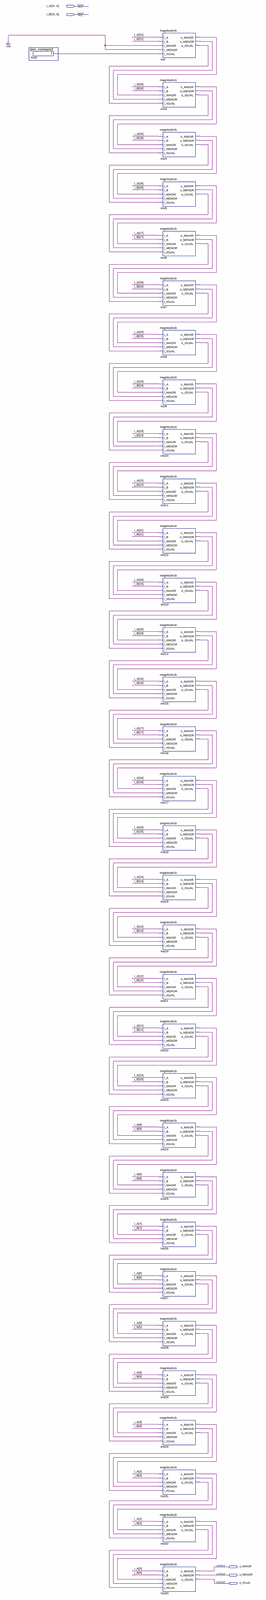
[diagram p0: schematic sheet, whole]
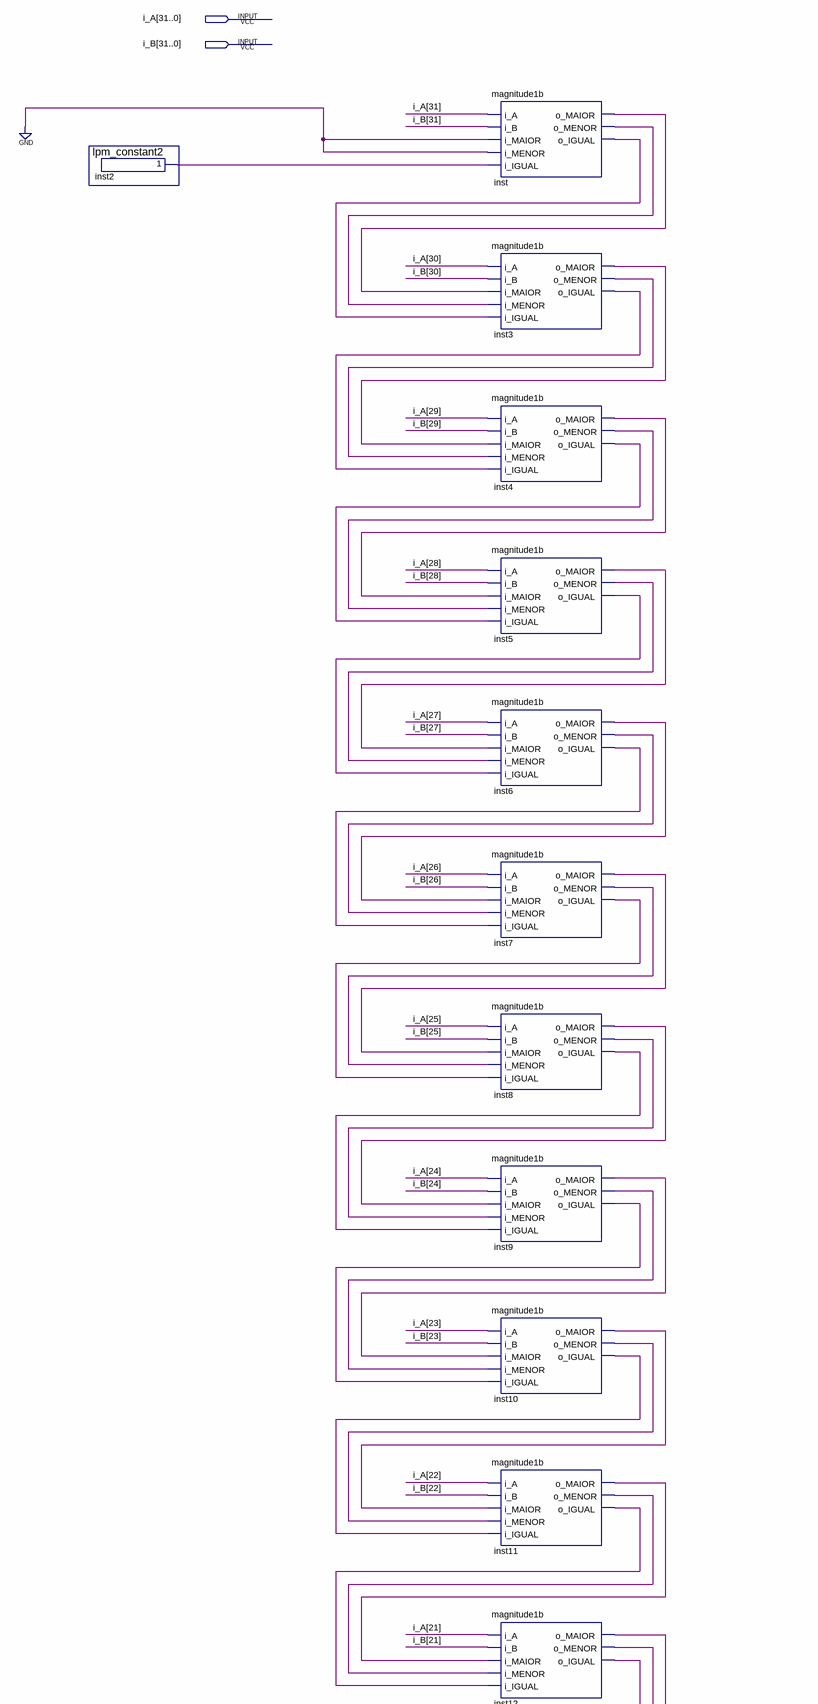
[diagram p1: schematic sheet, upper part]
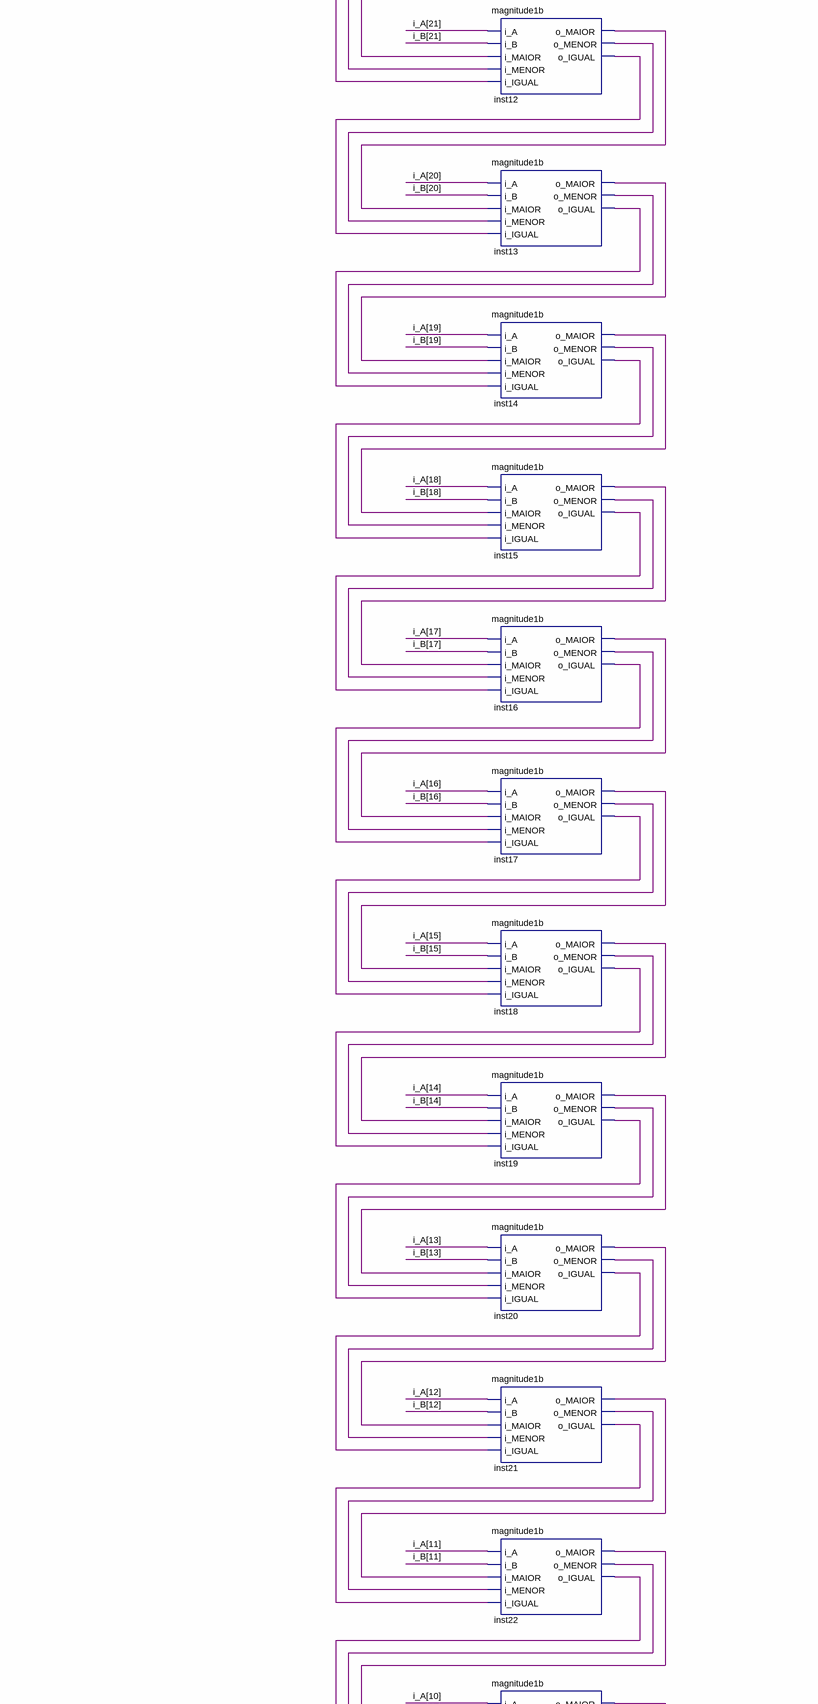
[diagram p2: schematic sheet, middle part]
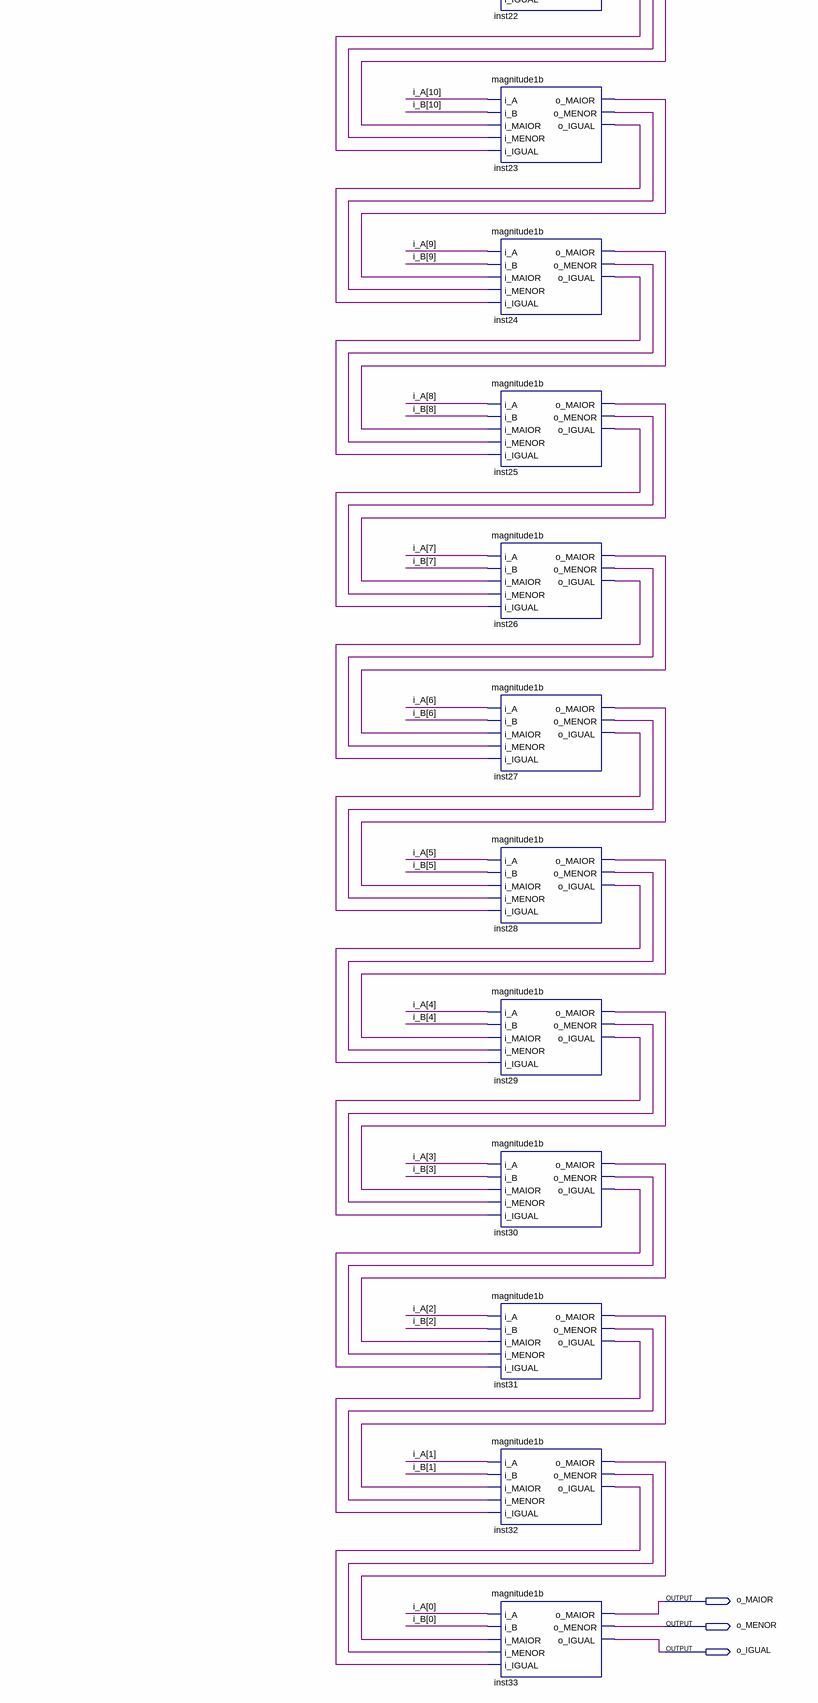
[diagram p3: schematic sheet, lower part]
// Quartus schematic magnitude32b.bdf as structural Verilog: 33 symbols, 5 pins
module magnitude32b (
  input  [31:0] i_A,
  input  [31:0] i_B,
  output o_MAIOR,
  output o_MENOR,
  output o_IGUAL
);

  wire inst2_result, inst3_o_igual, inst3_o_maior, inst3_o_menor, inst4_o_igual, inst4_o_maior,
       inst4_o_menor, inst5_o_igual, inst5_o_maior, inst5_o_menor, inst6_o_igual, inst6_o_maior,
       inst6_o_menor, inst7_o_igual, inst7_o_maior, inst7_o_menor, inst8_o_igual, inst8_o_maior,
       inst8_o_menor, inst9_o_igual, inst9_o_maior, inst9_o_menor, inst10_o_igual, inst10_o_maior,
       inst10_o_menor, inst11_o_igual, inst11_o_maior, inst11_o_menor, inst12_o_igual, inst12_o_maior,
       inst12_o_menor, inst13_o_igual, inst13_o_maior, inst13_o_menor, inst14_o_igual, inst14_o_maior,
       inst14_o_menor, inst15_o_igual, inst15_o_maior, inst15_o_menor, inst16_o_igual, inst16_o_maior,
       inst16_o_menor, inst17_o_igual, inst17_o_maior, inst17_o_menor, inst18_o_igual, inst18_o_maior,
       inst18_o_menor, inst19_o_igual, inst19_o_maior, inst19_o_menor, inst20_o_igual, inst20_o_maior,
       inst20_o_menor, inst21_o_igual, inst21_o_maior, inst21_o_menor, inst22_o_igual, inst22_o_maior,
       inst22_o_menor, inst23_o_igual, inst23_o_maior, inst23_o_menor, inst24_o_igual, inst24_o_maior,
       inst24_o_menor, inst25_o_igual, inst25_o_maior, inst25_o_menor, inst26_o_igual, inst26_o_maior,
       inst26_o_menor, inst27_o_igual, inst27_o_maior, inst27_o_menor, inst28_o_igual, inst28_o_maior,
       inst28_o_menor, inst29_o_igual, inst29_o_maior, inst29_o_menor, inst30_o_igual, inst30_o_maior,
       inst30_o_menor, inst31_o_igual, inst31_o_maior, inst31_o_menor, inst32_o_igual, inst32_o_maior,
       inst32_o_menor, inst_o_igual, inst_o_maior, inst_o_menor;

  lpm_constant2 inst2 (.result(inst2_result));
  magnitude1b inst (
    .i_A(i_A[31]), .i_B(i_B[31]), .i_MAIOR(1'b0), .i_MENOR(1'b0), .i_IGUAL(inst2_result),
    .o_MAIOR(inst_o_maior), .o_MENOR(inst_o_menor), .o_IGUAL(inst_o_igual));
  magnitude1b inst3 (
    .i_A(i_A[30]), .i_B(i_B[30]), .i_MAIOR(inst_o_maior), .i_MENOR(inst_o_menor), .i_IGUAL(inst_o_igual),
    .o_MAIOR(inst3_o_maior), .o_MENOR(inst3_o_menor), .o_IGUAL(inst3_o_igual));
  magnitude1b inst4 (
    .i_A(i_A[29]), .i_B(i_B[29]), .i_MAIOR(inst3_o_maior), .i_MENOR(inst3_o_menor), .i_IGUAL(inst3_o_igual),
    .o_MAIOR(inst4_o_maior), .o_MENOR(inst4_o_menor), .o_IGUAL(inst4_o_igual));
  magnitude1b inst5 (
    .i_A(i_A[28]), .i_B(i_B[28]), .i_MAIOR(inst4_o_maior), .i_MENOR(inst4_o_menor), .i_IGUAL(inst4_o_igual),
    .o_MAIOR(inst5_o_maior), .o_MENOR(inst5_o_menor), .o_IGUAL(inst5_o_igual));
  magnitude1b inst6 (
    .i_A(i_A[27]), .i_B(i_B[27]), .i_MAIOR(inst5_o_maior), .i_MENOR(inst5_o_menor), .i_IGUAL(inst5_o_igual),
    .o_MAIOR(inst6_o_maior), .o_MENOR(inst6_o_menor), .o_IGUAL(inst6_o_igual));
  magnitude1b inst7 (
    .i_A(i_A[26]), .i_B(i_B[26]), .i_MAIOR(inst6_o_maior), .i_MENOR(inst6_o_menor), .i_IGUAL(inst6_o_igual),
    .o_MAIOR(inst7_o_maior), .o_MENOR(inst7_o_menor), .o_IGUAL(inst7_o_igual));
  magnitude1b inst8 (
    .i_A(i_A[25]), .i_B(i_B[25]), .i_MAIOR(inst7_o_maior), .i_MENOR(inst7_o_menor), .i_IGUAL(inst7_o_igual),
    .o_MAIOR(inst8_o_maior), .o_MENOR(inst8_o_menor), .o_IGUAL(inst8_o_igual));
  magnitude1b inst9 (
    .i_A(i_A[24]), .i_B(i_B[24]), .i_MAIOR(inst8_o_maior), .i_MENOR(inst8_o_menor), .i_IGUAL(inst8_o_igual),
    .o_MAIOR(inst9_o_maior), .o_MENOR(inst9_o_menor), .o_IGUAL(inst9_o_igual));
  magnitude1b inst10 (
    .i_A(i_A[23]), .i_B(i_B[23]), .i_MAIOR(inst9_o_maior), .i_MENOR(inst9_o_menor), .i_IGUAL(inst9_o_igual),
    .o_MAIOR(inst10_o_maior), .o_MENOR(inst10_o_menor), .o_IGUAL(inst10_o_igual));
  magnitude1b inst11 (
    .i_A(i_A[22]), .i_B(i_B[22]), .i_MAIOR(inst10_o_maior), .i_MENOR(inst10_o_menor),
    .i_IGUAL(inst10_o_igual), .o_MAIOR(inst11_o_maior), .o_MENOR(inst11_o_menor), .o_IGUAL(inst11_o_igual));
  magnitude1b inst12 (
    .i_A(i_A[21]), .i_B(i_B[21]), .i_MAIOR(inst11_o_maior), .i_MENOR(inst11_o_menor),
    .i_IGUAL(inst11_o_igual), .o_MAIOR(inst12_o_maior), .o_MENOR(inst12_o_menor), .o_IGUAL(inst12_o_igual));
  magnitude1b inst13 (
    .i_A(i_A[20]), .i_B(i_B[20]), .i_MAIOR(inst12_o_maior), .i_MENOR(inst12_o_menor),
    .i_IGUAL(inst12_o_igual), .o_MAIOR(inst13_o_maior), .o_MENOR(inst13_o_menor), .o_IGUAL(inst13_o_igual));
  magnitude1b inst14 (
    .i_A(i_A[19]), .i_B(i_B[19]), .i_MAIOR(inst13_o_maior), .i_MENOR(inst13_o_menor),
    .i_IGUAL(inst13_o_igual), .o_MAIOR(inst14_o_maior), .o_MENOR(inst14_o_menor), .o_IGUAL(inst14_o_igual));
  magnitude1b inst15 (
    .i_A(i_A[18]), .i_B(i_B[18]), .i_MAIOR(inst14_o_maior), .i_MENOR(inst14_o_menor),
    .i_IGUAL(inst14_o_igual), .o_MAIOR(inst15_o_maior), .o_MENOR(inst15_o_menor), .o_IGUAL(inst15_o_igual));
  magnitude1b inst16 (
    .i_A(i_A[17]), .i_B(i_B[17]), .i_MAIOR(inst15_o_maior), .i_MENOR(inst15_o_menor),
    .i_IGUAL(inst15_o_igual), .o_MAIOR(inst16_o_maior), .o_MENOR(inst16_o_menor), .o_IGUAL(inst16_o_igual));
  magnitude1b inst17 (
    .i_A(i_A[16]), .i_B(i_B[16]), .i_MAIOR(inst16_o_maior), .i_MENOR(inst16_o_menor),
    .i_IGUAL(inst16_o_igual), .o_MAIOR(inst17_o_maior), .o_MENOR(inst17_o_menor), .o_IGUAL(inst17_o_igual));
  magnitude1b inst18 (
    .i_A(i_A[15]), .i_B(i_B[15]), .i_MAIOR(inst17_o_maior), .i_MENOR(inst17_o_menor),
    .i_IGUAL(inst17_o_igual), .o_MAIOR(inst18_o_maior), .o_MENOR(inst18_o_menor), .o_IGUAL(inst18_o_igual));
  magnitude1b inst19 (
    .i_A(i_A[14]), .i_B(i_B[14]), .i_MAIOR(inst18_o_maior), .i_MENOR(inst18_o_menor),
    .i_IGUAL(inst18_o_igual), .o_MAIOR(inst19_o_maior), .o_MENOR(inst19_o_menor), .o_IGUAL(inst19_o_igual));
  magnitude1b inst20 (
    .i_A(i_A[13]), .i_B(i_B[13]), .i_MAIOR(inst19_o_maior), .i_MENOR(inst19_o_menor),
    .i_IGUAL(inst19_o_igual), .o_MAIOR(inst20_o_maior), .o_MENOR(inst20_o_menor), .o_IGUAL(inst20_o_igual));
  magnitude1b inst21 (
    .i_A(i_A[12]), .i_B(i_B[12]), .i_MAIOR(inst20_o_maior), .i_MENOR(inst20_o_menor),
    .i_IGUAL(inst20_o_igual), .o_MAIOR(inst21_o_maior), .o_MENOR(inst21_o_menor), .o_IGUAL(inst21_o_igual));
  magnitude1b inst22 (
    .i_A(i_A[11]), .i_B(i_B[11]), .i_MAIOR(inst21_o_maior), .i_MENOR(inst21_o_menor),
    .i_IGUAL(inst21_o_igual), .o_MAIOR(inst22_o_maior), .o_MENOR(inst22_o_menor), .o_IGUAL(inst22_o_igual));
  magnitude1b inst23 (
    .i_A(i_A[10]), .i_B(i_B[10]), .i_MAIOR(inst22_o_maior), .i_MENOR(inst22_o_menor),
    .i_IGUAL(inst22_o_igual), .o_MAIOR(inst23_o_maior), .o_MENOR(inst23_o_menor), .o_IGUAL(inst23_o_igual));
  magnitude1b inst24 (
    .i_A(i_A[9]), .i_B(i_B[9]), .i_MAIOR(inst23_o_maior), .i_MENOR(inst23_o_menor), .i_IGUAL(inst23_o_igual),
    .o_MAIOR(inst24_o_maior), .o_MENOR(inst24_o_menor), .o_IGUAL(inst24_o_igual));
  magnitude1b inst25 (
    .i_A(i_A[8]), .i_B(i_B[8]), .i_MAIOR(inst24_o_maior), .i_MENOR(inst24_o_menor), .i_IGUAL(inst24_o_igual),
    .o_MAIOR(inst25_o_maior), .o_MENOR(inst25_o_menor), .o_IGUAL(inst25_o_igual));
  magnitude1b inst26 (
    .i_A(i_A[7]), .i_B(i_B[7]), .i_MAIOR(inst25_o_maior), .i_MENOR(inst25_o_menor), .i_IGUAL(inst25_o_igual),
    .o_MAIOR(inst26_o_maior), .o_MENOR(inst26_o_menor), .o_IGUAL(inst26_o_igual));
  magnitude1b inst27 (
    .i_A(i_A[6]), .i_B(i_B[6]), .i_MAIOR(inst26_o_maior), .i_MENOR(inst26_o_menor), .i_IGUAL(inst26_o_igual),
    .o_MAIOR(inst27_o_maior), .o_MENOR(inst27_o_menor), .o_IGUAL(inst27_o_igual));
  magnitude1b inst28 (
    .i_A(i_A[5]), .i_B(i_B[5]), .i_MAIOR(inst27_o_maior), .i_MENOR(inst27_o_menor), .i_IGUAL(inst27_o_igual),
    .o_MAIOR(inst28_o_maior), .o_MENOR(inst28_o_menor), .o_IGUAL(inst28_o_igual));
  magnitude1b inst29 (
    .i_A(i_A[4]), .i_B(i_B[4]), .i_MAIOR(inst28_o_maior), .i_MENOR(inst28_o_menor), .i_IGUAL(inst28_o_igual),
    .o_MAIOR(inst29_o_maior), .o_MENOR(inst29_o_menor), .o_IGUAL(inst29_o_igual));
  magnitude1b inst30 (
    .i_A(i_A[3]), .i_B(i_B[3]), .i_MAIOR(inst29_o_maior), .i_MENOR(inst29_o_menor), .i_IGUAL(inst29_o_igual),
    .o_MAIOR(inst30_o_maior), .o_MENOR(inst30_o_menor), .o_IGUAL(inst30_o_igual));
  magnitude1b inst31 (
    .i_A(i_A[2]), .i_B(i_B[2]), .i_MAIOR(inst30_o_maior), .i_MENOR(inst30_o_menor), .i_IGUAL(inst30_o_igual),
    .o_MAIOR(inst31_o_maior), .o_MENOR(inst31_o_menor), .o_IGUAL(inst31_o_igual));
  magnitude1b inst32 (
    .i_A(i_A[1]), .i_B(i_B[1]), .i_MAIOR(inst31_o_maior), .i_MENOR(inst31_o_menor), .i_IGUAL(inst31_o_igual),
    .o_MAIOR(inst32_o_maior), .o_MENOR(inst32_o_menor), .o_IGUAL(inst32_o_igual));
  magnitude1b inst33 (
    .i_A(i_A[0]), .i_B(i_B[0]), .i_MAIOR(inst32_o_maior), .i_MENOR(inst32_o_menor), .i_IGUAL(inst32_o_igual),
    .o_MAIOR(o_MAIOR), .o_MENOR(o_MENOR), .o_IGUAL(o_IGUAL));
endmodule
